# EAGLE schematic Timer Autoradio FlipFlop (EAGLE 6.4)
Circuito per mantenere l'autoradio acceso per ancora 15 minuti dopo aver spento la macchina.
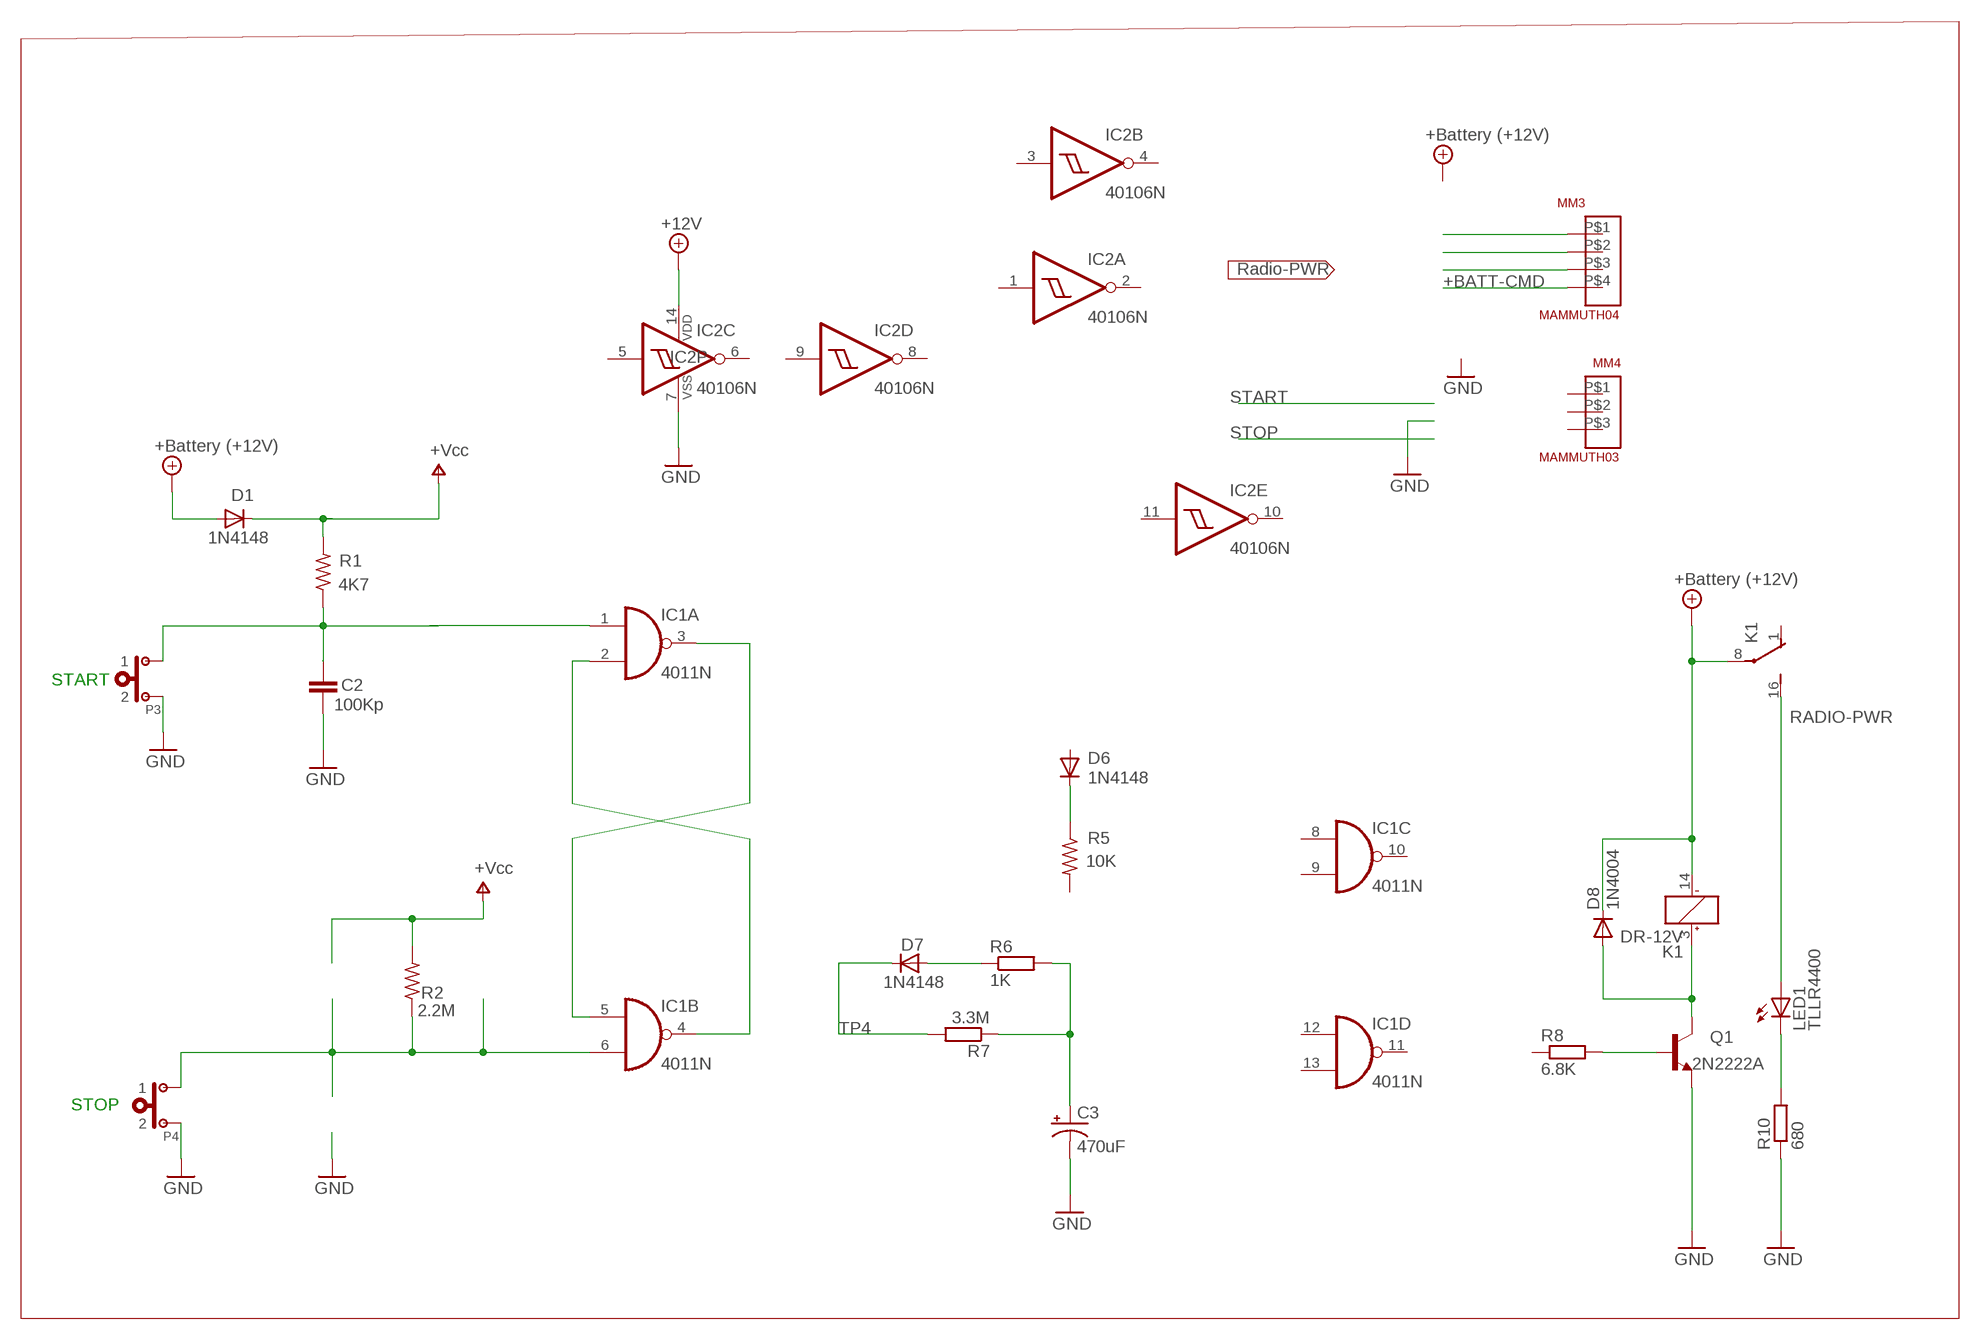
[diagram p0: schematic, sheet 1]

## Parts
C2  100Kp  C-EU025-025X050  [C025-025X050]
C3  470uF  CPOL-USE3.5-8  [E3,5-8]
D1  1N4148  1N4148DO35-10  [DO35-10]
D6  1N4148  1N4148DO35-10  [DO35-10]
D7  1N4148  1N4148DO35-10  [DO35-10]
D8  1N4004  [DO41-10]
IC1  4011N  [DIL14]
IC2  40106N  [DIL14]
K1  DR-12V  [DR-1]
LED1  TLLR4400  [LED3MM]
MM3  MAMMUTH04  [MAMMUTH04]
MM4  MAMMUTH03  [MAMMUTH03]
P3  PULSANTENO  [SIP02]
P4  PULSANTENO  [SIP02]
Q1  2N2222A  [TO18]
R1  4K7  R-US_0207/12  [0207/12]
R2  2.2M  R-US_0207/12  [0207/12]
R5  10K  R-US_0207/12  [0207/12]
R6  1K  R-EU_0207/10  [0207/10]
R7  3.3M  R-EU_0207/10  [0207/10]
R8  6.8K  R-EU_0207/10  [0207/10]
R10  680  R-EU_0207/10  [0207/10]

## Nets
+12V: D1.A D8.C IC2.14(P:VDD) K1.8(-2:P) K1.14(-1:-) ; supply symbol labelled +Battery (+12V)
GND: C3.- IC2.7(P:VSS) P3.2 P4.2 Q1.1(E) R10.1
N$2: Q1.2(B) R8.2
N$3: D8.A K1.3(-1:+) Q1.3(C)
N$4: D6.C R5.1
N$5: IC1.2(A:I1) IC1.4(B:O)
N$8: LED1.K(C) R10.2
N$12: IC1.6(B:I1) P4.1 R2.1
N$13: IC1.3(A:O) IC1.5(B:I0)
RADIO-PWR: K1.16(-2:S) LED1.A
START: D7.A R6.1
STOP: C2.1 IC1.1(A:I0) P3.1 R1.1
TP4: D7.C R7.2
TP4A: C3.+ R6.2 R7.1
V+: D1.C R1.2 R2.2 ; supply symbol labelled +Vcc
Unconnected: C2.2 D6.A IC1.8(C:I0) IC1.9(C:I1) IC1.10(C:O) IC1.11(D:O) IC1.12(D:I0) IC1.13(D:I1) IC2.1(A:I) IC2.2(A:O) IC2.3(B:I) IC2.4(B:O) IC2.5(C:I) IC2.6(C:O) IC2.8(D:O) IC2.9(D:I) IC2.10(E:O) IC2.11(E:I) IC2.12(F:O) IC2.13(F:I) K1.1(-2:O) MM3.P$1 MM3.P$2 MM3.P$3 MM3.P$4 MM4.P$1 MM4.P$2 MM4.P$3 R5.2 R8.1

## Notes on the sheet
- START
- STOP

## Power pins joined to a net without a drawn wire
VDD: IC1.14(P:VDD)
VSS: IC1.7(P:VSS)

## Library data of the parts
C2 = rcl:C-EU: CAPACITOR, European symbol
C3 = rcl:CPOL-US: POLARIZED CAPACITOR, American symbol
D1 D6 D7 = diode:1N4148: DIODE high speed (Philips)
D8 = diode:1N4004: DIODE general purpose rectifier, 1 A
IC1 = Ln-40xx:4011: Quad 2-input NAND
IC2 = Ln-40xx:40106: Hex SCHMITT TRIGGER
K1 = relay:DR-*V: HIGHLY RELIABLE MINIATURE DIP RELAYS NAiS Source: www.mew-europe.com/ac/download/ datasheet/relay/dr_en.pdf; MPN: DR-12V; OC_FARNELL: 1124066; OC_NEWARK: 91K6794
LED1 = Loreto:TLLR4400: Low Current (2mA) LED 3 mm Tinted Diffused Package color RED Source: Data sheet <http://www.farnell.com/datasheets/391100.pdf>; MF: VISHAY SEMICONDUCTOR; OC_FARNELL: 1612437
MM3 = Ln-Varie:MAMMUTH04: Mammuth 04
MM4 = Ln-Varie:MAMMUTH03: Mammuth 03
P3 P4 = Ln-Varie:PULSANTENO: Pulsante NO
Q1 = transistor-npn:2N2222*: NPN Transistor
R1 R2 R5 = rcl:R-US_: RESISTOR, American symbol
R6-R8 R10 = rcl:R-EU_: RESISTOR, European symbol